# Altium schematic sheet CAN_Sniffer_HAT.SchDoc
size A4; SheetNumber: 1; SheetTotal: 1
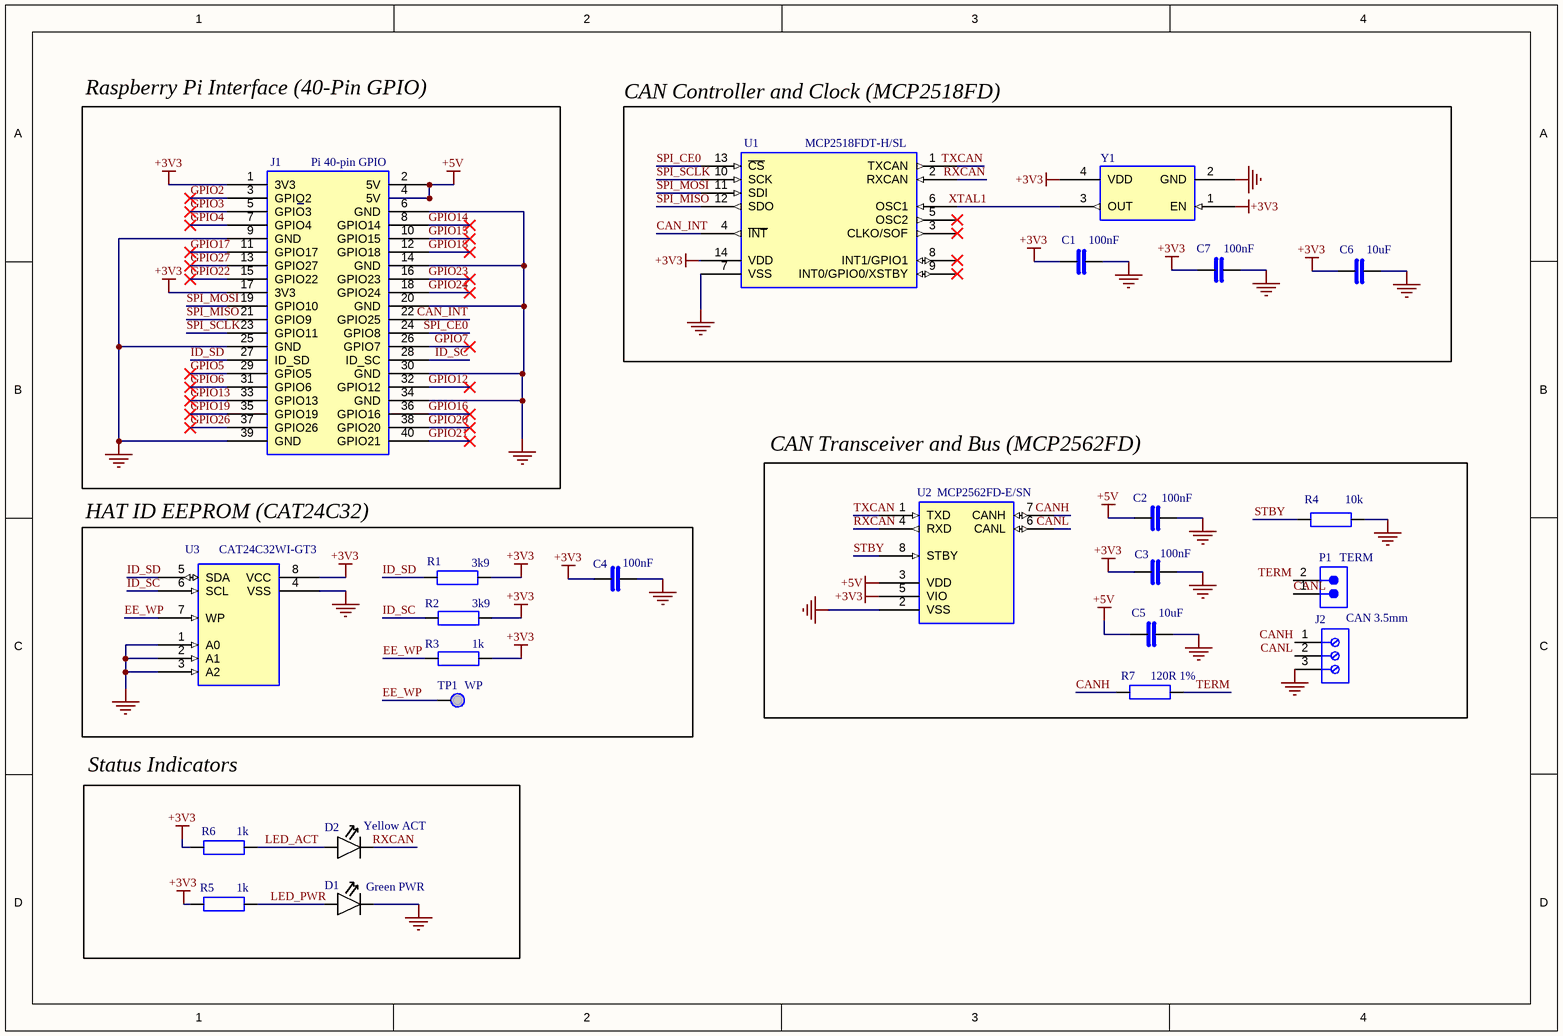
[diagram p0: CAN_Sniffer_HAT.SchDoc]

## Parts
C1  100nF  [0805]
C2  100nF  [0805]
C3  100nF  [0805]
C4  100nF  [0805]
C5  10uF  [0805]
C6  10uF  [0805]
C7  100nF  [0805]
D1  Green PWR  [LED_0805]
D2  Yellow ACT  [LED_0805]
J1  Pi 40-pin GPIO  [HDR_2X20_254]
J2  CAN 3.5mm  [691214110003]
P1  TERM  [SMTC-TSW-102-26-XX-S]
R1  3k9  [0805]
R2  3k9  [0805]
R3  1k  [0805]
R4  10k  [0805]
R5  1k  [0805]
R6  1k  [0805]
R7  120R 1%  [0805]
TP1  WP  [TESTPOINT_60]
U1  MCP2518FDT-H/SL  [SOIC-14_150MIL]
U2  MCP2562FD-E/SN  [SOIC-8_150MIL]
U3  CAT24C32WI-GT3  [SOIC-8_150MIL]
Y1  OSCILLATOR  [XTAL_3225_4P]  (value not drawn)

## Blocks framed on the sheet
Raspberry Pi Interface (40-Pin GPIO): J1
CAN Controller and Clock (MCP2518FD): C1 C6 C7 U1 Y1
CAN Transceiver and Bus (MCP2562FD): C2 C3 C5 J2 P1 R4 R7 U2
HAT ID EEPROM (CAT24C32): C4 R1-R3 TP1 U3
Status Indicators: D1 D2 R5 R6

## Nets
+3V3: C1.1 C3.1 C4.1 C6.1 C7.1 J1.1(3V3) J1.17(3V3) R1.2 R2.2 R3.2 R5.1 R6.1 U1.14(VDD) U2.5(VIO) U3.8(VCC) Y1.1(EN) Y1.4(VDD)
+5V: C2.1 C5.1 J1.2(5V) J1.4(5V) U2.3(VDD)
GND: C1.2 C2.2 C3.2 C4.2 C5.2 C6.2 C7.2 D1.2(K) J1.6(GND) J1.9(GND) J1.14(GND) J1.20(GND) J1.25(GND) J1.30(GND) J1.34(GND) J1.39(GND) J2.3 R4.2 U1.7(VSS) U2.2(VSS) U3.1(A0) U3.2(A1) U3.3(A2) U3.4(VSS) Y1.2(GND)
CAN_INT: J1.22(GPIO25) U1.4(~{INT})
CANH: J2.1 R7.1 U2.7(CANH)
CANL: J2.2 P1.1 U2.6(CANL)
EE_WP: R3.1 TP1.1(TP) U3.7(WP)
GPIO2: J1.3(GPIO2)
GPIO3: J1.5(GPIO3)
GPIO4: J1.7(GPIO4)
GPIO5: J1.29(GPIO5)
GPIO6: J1.31(GPIO6)
GPIO7: J1.26(GPIO7)
GPIO12: J1.32(GPIO12)
GPIO13: J1.33(GPIO13)
GPIO14: J1.8(GPIO14)
GPIO15: J1.10(GPIO15)
GPIO16: J1.36(GPIO16)
GPIO17: J1.11(GPIO17)
GPIO18: J1.12(GPIO18)
GPIO19: J1.35(GPIO19)
GPIO20: J1.38(GPIO20)
GPIO21: J1.40(GPIO21)
GPIO22: J1.15(GPIO22)
GPIO23: J1.16(GPIO23)
GPIO24: J1.18(GPIO24)
GPIO26: J1.37(GPIO26)
GPIO27: J1.13(GPIO27)
ID_SC: J1.28(ID_SC) R2.1 U3.6(SCL)
ID_SD: J1.27(ID_SD) R1.1 U3.5(SDA)
LED_ACT: D2.1(A) R6.2
LED_PWR: D1.1(A) R5.2
RXCAN: D2.2(K) U1.2(RXCAN) U2.4(RXD)
SPI_CE0: J1.24(GPIO8) U1.13(~{CS})
SPI_MISO: J1.21(GPIO9) U1.12(SDO)
SPI_MOSI: J1.19(GPIO10) U1.11(SDI)
SPI_SCLK: J1.23(GPIO11) U1.10(SCK)
STBY: R4.1 U2.8(STBY)
TERM: P1.2 R7.2
TXCAN: U1.1(TXCAN) U2.1(TXD)
XTAL1: U1.6(OSC1) Y1.3(OUT)

Not connected (* = marked no-connect by the designer): U1 3(CLKO/SOF)* 5(OSC2)* 8(INT1/GPIO1)* 9(INT0/GPIO0/XSTBY)*

## Notes on the sheet
- DWG. NO.
- REV.
- SHT.
- REVISION
- DESCRIPTION
- DATE
- APPROVED
- THIS DOCUMENT AND THE DATA DISCLOSED HEREIN OR HEREWITH IS THE PROPERTY OF ALTIUM LIMITED AND MAY BE FREELY DISTRIBUTED IN WHOLE. NO RIGHTS ARE RESERVED OR EXPRESS OR IMPLIED WARANTEE GIVEN.
- ENG:
- DSN:
- APPROVALS
- PROJECT
- DOCUMENT REVISION:
- DESIGN ITEM:
- CHK:
- BOM:
- REFERENCE DOCUMENTS
- PROJECT REVISION:
- TITLE
- FAB DWG:
- PCB DWG:
- ASSY DWG:
- SCALE:
- SIZE
- C
- CAGE CODE
- FILE NAME
- DWG NO.
- SHEET
- OF
- REV

## Library data of the parts
C1-C7 = CAP: Capacitor, non-polarised, 0805
D1 D2 = LED: LED, 0805
J1 = HDR_2X20_PI: Raspberry Pi 40-pin GPIO header, 2x20, 2.54 mm
J2 = CMP-1502-02466-3: 2141 Series 3.5MM Pitch Straight, Pcb Terminal Block, Through Hole, 3 Way; Wire Gauge (Max): 24AWG; Current Rating: 10A; Wire Gauge (Min): 16AWG; Plating: Brass, Steel; Number of Levels: 1; Voltage Rating: 300V; Number of Contacts: 3; Pitch: 3.5052mm; Stripping Length: -6mm; Min Operating Temperature: -40°C; Height: 12.2mm; Length: 7.4mm; Termination: Screw; Contact Plating: Brass, Tin; Housing Material: Nylon; Packaging: Box; Contact Material: Brass; Max Operating Temperature: 105°C; Number of Pins: 3; Wire/Cable Gauge: 24AWG; Lead Pitch: 3.5mm; Width: 10.9mm; Color: Blue, Green; Number of Positions Per Level: 3; Mount: Through Hole; RoHS: Compliant; Voltage: 300V; Current: 10A
P1 = CMP-1024-00330-1: 0.025" SQ Post Header, Through-hole, Vertical, -55 to 125 degC, 2.54 mm Pitch, 2-Pin, Male, RoHS; Manufacturer: Samtec; PartNumber: TSW-102-26-L-S; Pitch: 2.54 mm; DatasheetVersion: F-214; PackageReference: TSW-102-26-XX-S; ComponentLink3Description: Package Specification; PackageDescription: .025[0.64] SQ. Post Terminal Strip Assembly; PackageVersion: DM, 8/1988; ComponentLink1Description: Manufacturer URL; ComponentLink2URL: http://www.samtec.com/documents/webfiles/pdf/TSW_TH.PDF; ComponentLink3URL: http://www.samtec.com/documents/webfiles/cpdf/TSW-XXX-XX-XXX-X-XX-XXX-MKT.pdf; ComponentLink2Description: Datasheet; Temperature Range: -55 to 125 degC; Mounting Technology: Through-hole; ComponentLink1URL: http://www.samtec.com; RoHS: True; Orientation: Vertical
R1-R7 = RES: Resistor, 0805
TP1 = TESTPOINT: Test point / probe pad
U1 = MCP2518FD: CAN FD controller, SPI, 8 Mbit/s, SOIC-14
U2 = MCP2562FD: CAN FD transceiver with VIO level shift, SOIC-8
U3 = CAT24C32: 32 kbit I2C EEPROM, 16-bit addressing, HAT ID EEPROM, SOIC-8